# Altium schematic sheet 2018_LedWhite.SchDoc
size A4
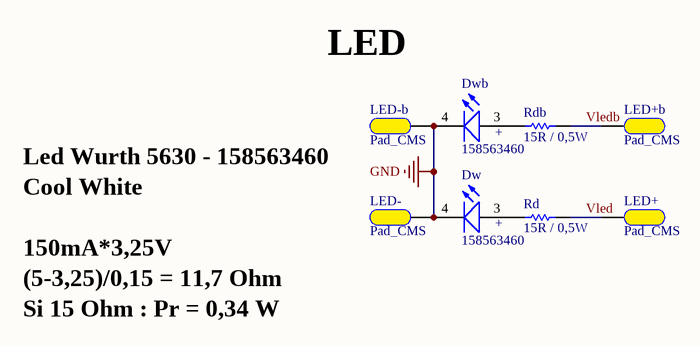
[diagram p0: 2018_LedWhite.SchDoc]

## Parts
Dw  158563460  [WL-SWTP_5630]
Dwb  158563460  [WL-SWTP_5630]
LED+  Pad_CMS  [PAD_CMS_5.08x2.54]
LED+b  Pad_CMS  [PAD_CMS_5.08x2.54]
LED-  Pad_CMS  [PAD_CMS_5.08x2.54]
LED-b  Pad_CMS  [PAD_CMS_5.08x2.54]
Rd  15R / 0,5W  [R1206_N]
Rdb  15R / 0,5W  [R1206_N]

## Nets
GND: Dw.4(K) Dwb.4(K) LED-.1 LED-b.1
Vled: LED+.1 Rd.2
Vledb: LED+b.1 Rdb.2
NetDw_3: Dw.3(A) Rd.1
NetDwb_3: Dwb.3(A) Rdb.1

## Notes on the sheet
- LED
- Led Wurth 5630 - 158563460
- Cool White
- 150mA*3,25V
- (5-3,25)/0,15 = 11,7 Ohm
- Si 15 Ohm : Pr = 0,34 W
- Title
- Size:
- Date:
- A4
- Number:
- Time:
- Revision:
- Sheet
- of
- File:
- (in symbol 158563460) +

## Library data of the parts
Dw Dwb = 158563460: WL-SWTP SMD White Top view PLCC, size 5630, Cool White; Forward Voltage: 3 V; Viewing Angle: 120°; Luminous Flux: 39 lm; Color Rendering Index: 90; Published Date: Jan 2017; Publisher: Wurth Elektronik; ComponentLink1Description: Manufacturer; ComponentLink1URL: http://www.we-online.de; ComponentLink2Description: Datasheet; ComponentLink2URL: http://katalog.we-online.de/led/datasheet/158563460.pdf; Part Number: 158563460; Size: 5630; Emitting Color: Cool White
LED+ LED+b LED- LED-b = Pad_CMS: Pad pour souder un fil; LatestRevisionNote: Mech Layer 1 removed.; PackageReference: PAD_CMS; Publisher: Damien Guitton
Rd Rdb = Resistor: Published: 8-Jun-2000; LatestRevisionDate: 17-Jul-2002; LatestRevisionNote: Re-released for DXP Platform.; PackageReference: AXIAL-0.5; Publisher: Altium Limited